# EAGLE schematic PT100-SensorPCB008 (EAGLE 7.5.0)
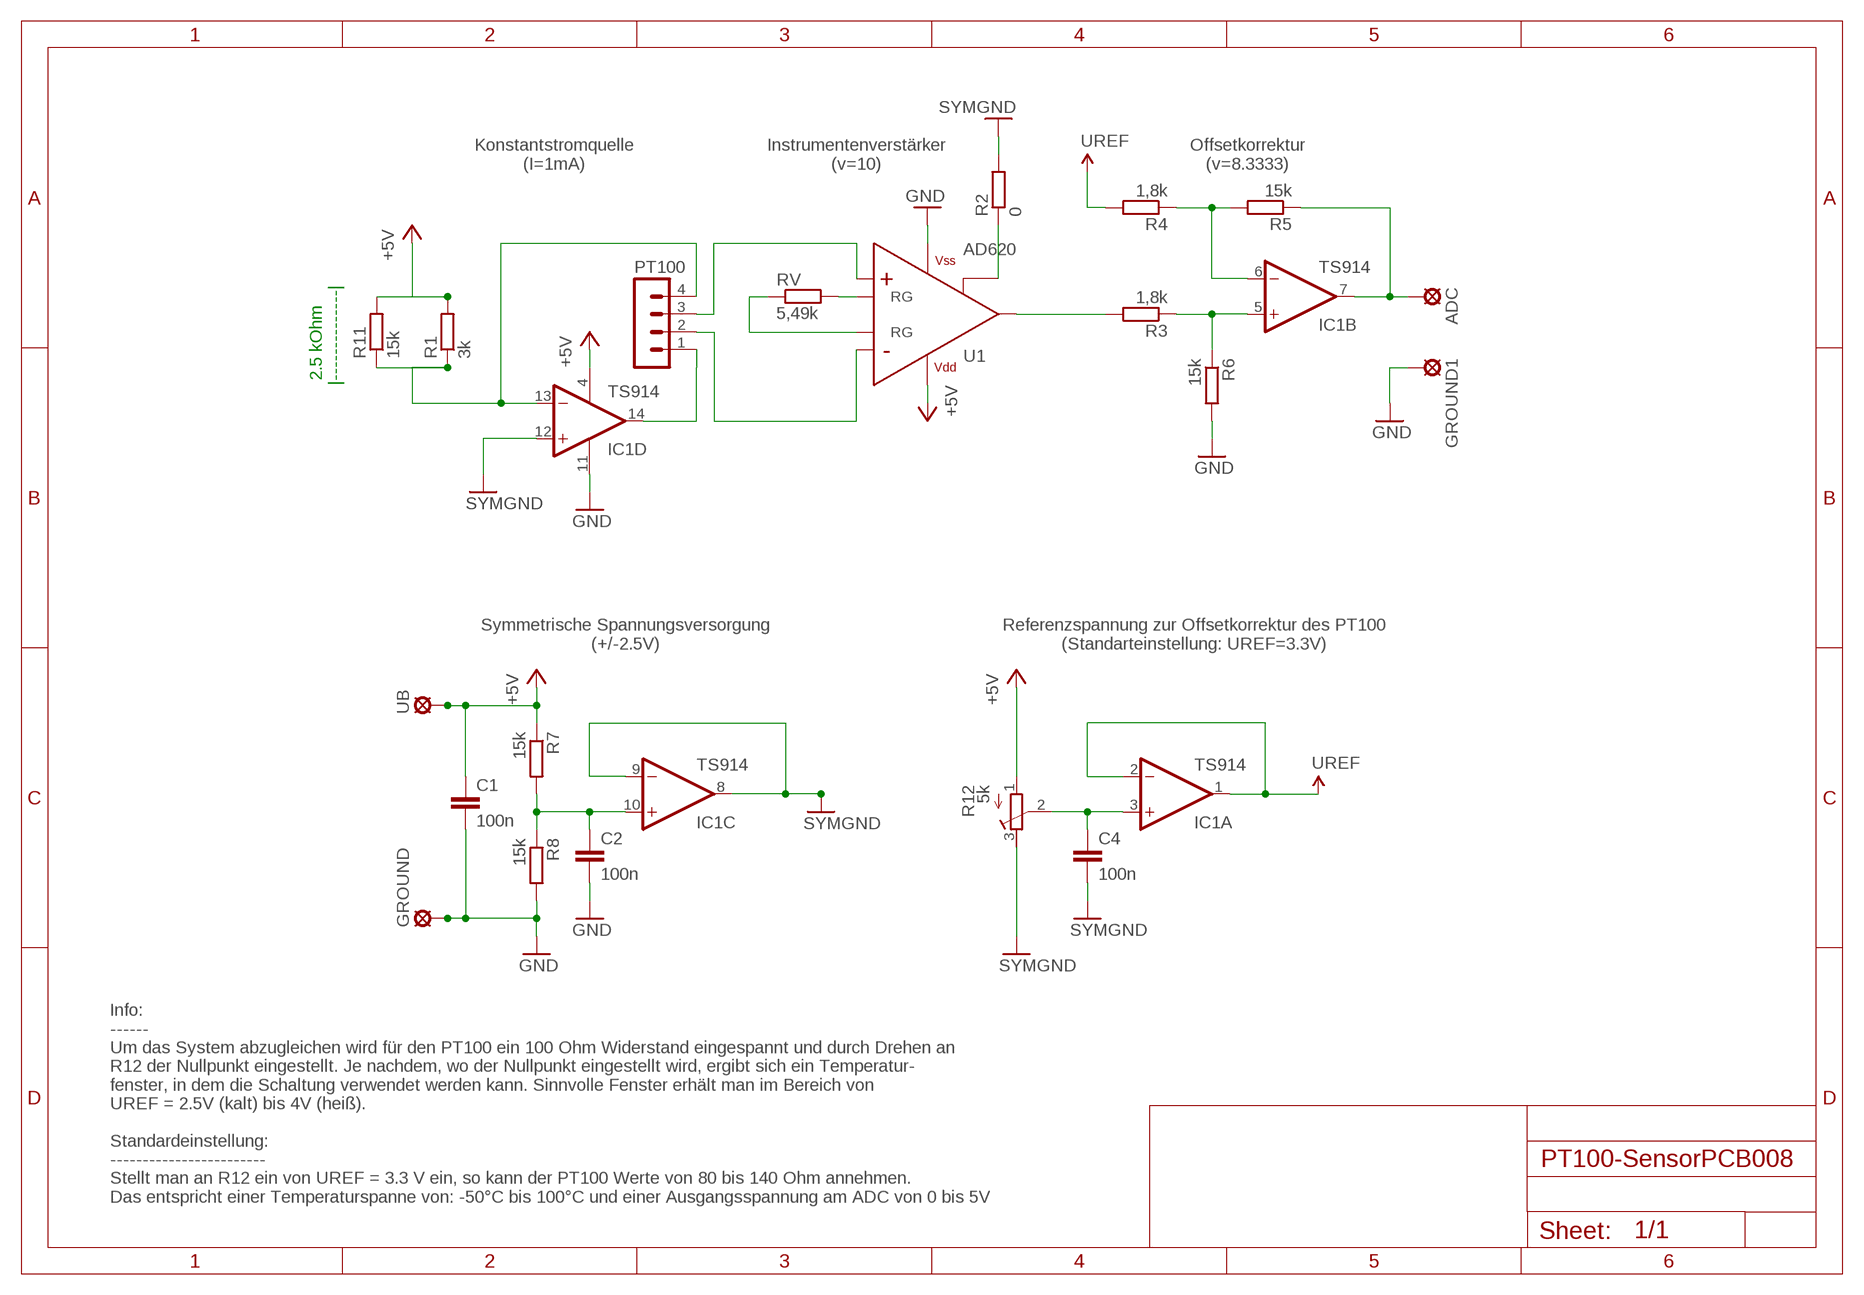
[diagram p0: schematic, sheet 1]

## Parts
ADC  LSP10  [LSP10]
C1  100n  C-EUC0805  [C0805]
C2  100n  C-EUC0805  [C0805]
C4  100n  C-EUC0805  [C0805]
GROUND  LSP10  [LSP10]
GROUND1  LSP10  [LSP10]
IC1  TS914  AD8684R  [SO14]
PT100  MA04-1  [MA04-1]
R1  3k  R-EU_R0805  [R0805]
R2  0  R-EU_R1206  [R1206]
R3  1,8k  R-EU_R0805  [R0805]
R4  1,8k  R-EU_R0805  [R0805]
R5  15k  R-EU_R0805  [R0805]
R6  15k  R-EU_R0805  [R0805]
R7  15k  R-EU_R0805  [R0805]
R8  15k  R-EU_R0805  [R0805]
R11  15k  R-EU_R0805  [R0805]
R12  5k  R-TRIMM3374  [RTRIM3374]
RV  5,49k  R-EU_0207/2V  [0207/2V]
U1  AD620  AD627SOIC  [SO08-TIGHT]
UB  LSP10  [LSP10]

## Nets
+3V3: C1.1 IC1.4(P:V+) R1.2 R7.1 R11.2 R12.1(A) U1.7(VS+) UB.MP ; supply symbol labelled +5V
GND: C1.2 C2.2 GROUND1.MP GROUND.MP IC1.11(P:V-) R6.2 R8.2 U1.4(VS-)
INST_A: R3.2 U1.6(OUTPUT)
INST_E-NEG: IC1.13(D:-IN) PT100.4 R1.1 R11.1
INST_E-POS: PT100.2 U1.2(IN-)
N$1: RV.2 U1.8(RG)
N$2: RV.1 U1.1(RG)
N$3: IC1.14(D:OUT) PT100.1
N$4: R2.1 U1.5(REF)
N$5: PT100.3 U1.3(IN+)
N$6: C4.1 IC1.3(A:+IN) R12.2(S)
N$7: IC1.6(B:-IN) R4.1 R5.2
N$8: IC1.5(B:+IN) R3.1 R6.1
N$9: ADC.MP IC1.7(B:OUT) R5.1
N$12: C2.1 IC1.10(C:+IN) R7.2 R8.1
SYMGND: C4.2 IC1.8(C:OUT) IC1.9(C:-IN) IC1.12(D:+IN) R2.2 R12.3(E)
UREF: IC1.1(A:OUT) IC1.2(A:-IN) R4.2

## Notes on the sheet
- Konstantstromquelle
  (I=1mA)
- Instrumentenverstärker
  (v=10)
- Offsetkorrektur
  (v=8.3333)
- 2.5 kOhm
  |--------------|
- Symmetrische Spannungsversorgung
  (+/-2.5V)
- Referenzspannung zur Offsetkorrektur des PT100
  (Standarteinstellung: UREF=3.3V)
- Info:
  ------
  Um das System abzugleichen wird für den PT100 ein 100 Ohm Widerstand eingespannt und durch Drehen an 
  R12 der Nullpunkt eingestellt. Je nachdem, wo der Nullpunkt eingestellt wird, ergibt sich ein Temperatur-
  fenster, in dem die Schaltung verwendet werden kann. Sinnvolle Fenster erhält man im Bereich von 
  UREF = 2.5V (kalt) bis 4V (heiß).
  
  Standardeinstellung:
  ------------------------
  Stellt man an R12 ein von UREF = 3.3 V ein, so kann der PT100 Werte von 80 bis 140 Ohm annehmen.
  Das entspricht einer Temperaturspanne von: -50°C bis 100°C und einer Ausgangsspannung am ADC von 0 bis 5V

## Library data of the parts
ADC GROUND GROUND1 UB = solpad:LSP10: SOLDER PAD drill 1.0 mm, distributor Buerklin, 12H555
C1 C2 C4 = rcl:C-EU: CAPACITOR, European symbol
IC1 = linear:AD8684: Quad Low Power, High Speed JFET Operational Amplifiers Source: http://www.analog.com/UploadedFiles/Data_Sheets/AD8682_8684.pdf
PT100 = con-lstb:MA04-1: PIN HEADER; OC_FARNELL: unknown; OC_NEWARK: unknown
R1-R8 R11 = rcl:R-EU_: RESISTOR, European symbol
R12 = rcl:R-TRIMM: Trimm resistor
RV = resistor:R-EU_: RESISTOR, European symbol
U1 = SparkFun-AnalogIC:AD627: Hall-effect-based isolated linear current sensor; PROD_ID: IC-13132; VALUE: AD627